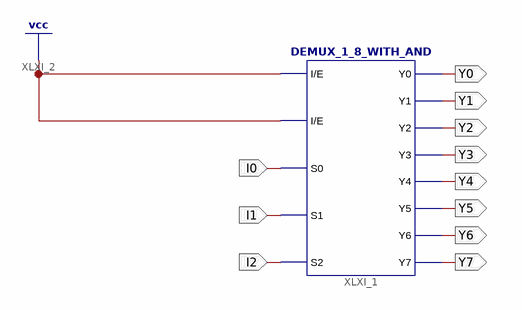
[diagram p0: schematic sheet 1]
// Xilinx ISE schematic DECODER_1_8.sch (artix7) as structural Verilog: 1 symbols, 11 ports
module DECODER_1_8 (
  input  I0,
  input  I1,
  input  I2,
  output Y0,
  output Y1,
  output Y2,
  output Y3,
  output Y4,
  output Y5,
  output Y6,
  output Y7
);

  DEMUX_1_8_WITH_AND XLXI_1 (
    .I(1'b1), .E(1'b1), .S0(I0), .S1(I1), .S2(I2), .Y0(Y0), .Y1(Y1), .Y2(Y2), .Y3(Y3), .Y4(Y4), .Y5(Y5),
    .Y6(Y6), .Y7(Y7));
endmodule
